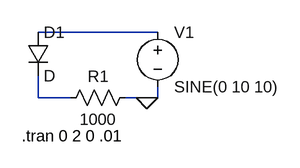
[diagram p0: schematic Prac-3 Half Wave.asc]
Prac-3 Half Wave.asc, the LTspice schematic file:
Version 4
SHEET 1 880 680
WIRE 256 96 80 96
WIRE 80 192 80 160
WIRE 128 192 80 192
WIRE 240 192 208 192
WIRE 256 192 256 176
WIRE 256 192 240 192
FLAG 240 192 0
SYMBOL diode 64 96 R0
SYMATTR InstName D1
SYMBOL voltage 256 80 R0
WINDOW 123 0 0 Left 0
WINDOW 39 0 0 Left 0
SYMATTR InstName V1
SYMATTR Value SINE(0 10 10)
SYMBOL res 224 176 R90
WINDOW 0 0 56 VBottom 2
WINDOW 3 32 56 VTop 2
SYMATTR InstName R1
SYMATTR Value 1000
TEXT 56 248 Left 2 !.tran 0 2 0 .01

The netlist it stands for:
* Prac-3 Half Wave.asc
D1 N001 N002 D
V1 N001 0 SINE(0 10 10)
R1 0 N002 1000
.model D D
.lib standard.dio
.tran 0 2 0 .01
.backanno
.end